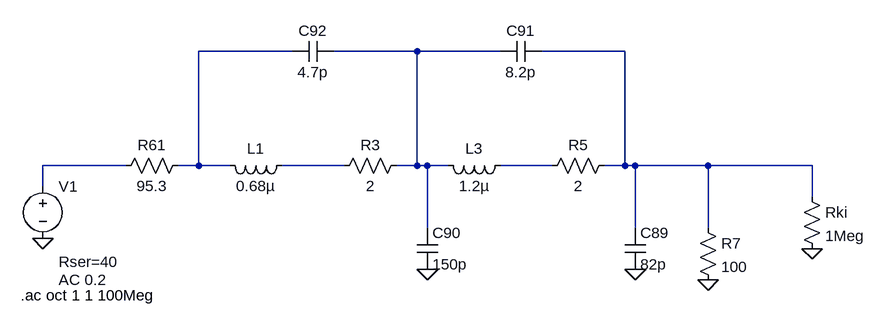
[diagram p0: schematic filter.asc]
filter.asc, the LTspice schematic file:
Version 4
SHEET 1 1180 680
WIRE 288 -96 144 -96
WIRE 480 -96 352 -96
WIRE 608 -96 480 -96
WIRE 800 -96 672 -96
WIRE 32 80 -96 80
WIRE 144 80 144 -96
WIRE 144 80 112 80
WIRE 192 80 144 80
WIRE 368 80 272 80
WIRE 480 80 480 -96
WIRE 480 80 448 80
WIRE 496 80 480 80
WIRE 528 80 496 80
WIRE 688 80 608 80
WIRE 800 80 800 -96
WIRE 800 80 768 80
WIRE 816 80 800 80
WIRE 928 80 816 80
WIRE 1088 80 928 80
WIRE -96 112 -96 80
WIRE 1088 128 1088 80
WIRE 496 176 496 80
WIRE 816 176 816 80
WIRE 928 176 928 80
FLAG -96 192 0
FLAG 496 240 0
FLAG 816 240 0
FLAG 928 256 0
FLAG 1088 208 0
SYMBOL voltage -96 96 R0
WINDOW 123 24 160 Left 0
WINDOW 39 24 132 Left 0
SYMATTR InstName V1
SYMATTR Value ""
SYMATTR Value2 AC 0.2
SYMATTR SpiceLine Rser=40
SYMBOL res 128 64 R90
WINDOW 0 0 56 VBottom 0
WINDOW 3 32 56 VTop 0
SYMATTR InstName R61
SYMATTR Value 95.3
SYMBOL res 464 64 R90
WINDOW 0 0 56 VBottom 0
WINDOW 3 32 56 VTop 0
SYMATTR InstName R3
SYMATTR Value 2
SYMBOL ind 288 64 R90
WINDOW 0 5 56 VBottom 0
WINDOW 3 32 56 VTop 0
SYMATTR InstName L1
SYMATTR Value 0.68µ
SYMBOL ind 624 64 R90
WINDOW 0 5 56 VBottom 0
WINDOW 3 32 56 VTop 0
SYMATTR InstName L3
SYMATTR Value 1.2µ
SYMBOL res 784 64 R90
WINDOW 0 0 56 VBottom 0
WINDOW 3 32 56 VTop 0
SYMATTR InstName R5
SYMATTR Value 2
SYMBOL cap 352 -112 R90
WINDOW 0 0 32 VBottom 0
WINDOW 3 32 32 VTop 0
SYMATTR InstName C92
SYMATTR Value 4.7p
SYMBOL cap 672 -112 R90
WINDOW 0 0 32 VBottom 0
WINDOW 3 32 32 VTop 0
SYMATTR InstName C91
SYMATTR Value 8.2p
SYMBOL cap 480 176 R0
SYMATTR InstName C90
SYMATTR Value 150p
SYMBOL cap 800 176 R0
SYMATTR InstName C89
SYMATTR Value 82p
SYMBOL res 912 160 R0
SYMATTR InstName R7
SYMATTR Value 100
SYMBOL res 1072 112 R0
SYMATTR InstName Rki
SYMATTR Value 1Meg
TEXT -130 280 Left 0 !.ac oct 1 1 100Meg

The netlist it stands for:
* filter.asc
V1 N004 0 AC 0.2 Rser=40
R61 N001 N004 95.3
R3 N002 N005 2
L1 N005 N001 0.68µ
L3 N006 N002 1.2µ
R5 N003 N006 2
C92 N002 N001 4.7p
C91 N003 N002 8.2p
C90 N002 0 150p
C89 N003 0 82p
R7 N003 0 100
Rki N003 0 1Meg
.ac oct 1 1 100Meg
.backanno
.end